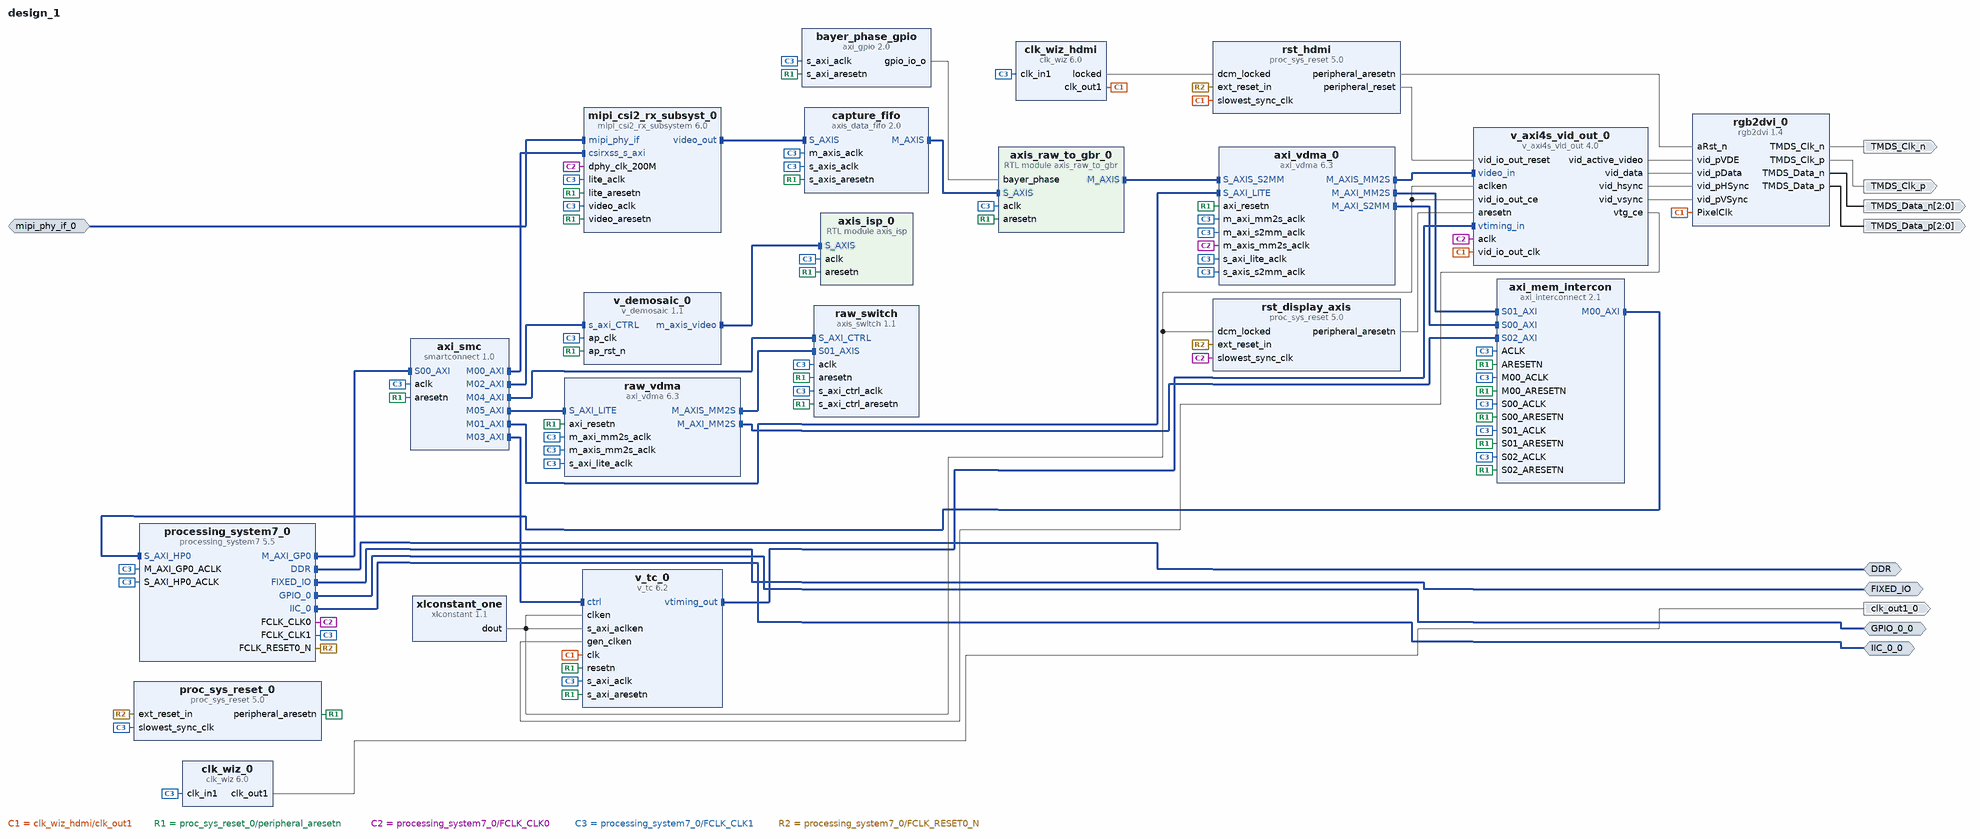
[diagram p0: block diagram of the top level]
# Vivado block design design_1, xc7z020clg400-1, Vivado 2025.2
create_bd_design design_1

create_bd_intf_port -mode Master -vlnv xilinx.com:interface:ddrx_rtl:1.0 DDR
create_bd_intf_port -mode Master -vlnv xilinx.com:display_processing_system7:fixedio_rtl:1.0 FIXED_IO
create_bd_intf_port -mode Master -vlnv xilinx.com:interface:iic_rtl:1.0 IIC_0_0
create_bd_intf_port -mode Master -vlnv xilinx.com:interface:gpio_rtl:1.0 GPIO_0_0
create_bd_intf_port -mode Slave -vlnv xilinx.com:interface:mipi_phy_rtl:1.0 mipi_phy_if_0
create_bd_port -dir O -type clk clk_out1_0
create_bd_port -dir O TMDS_Clk_p
create_bd_port -dir O TMDS_Clk_n
create_bd_port -dir O -from 2 -to 0 TMDS_Data_p
create_bd_port -dir O -from 2 -to 0 TMDS_Data_n

create_bd_cell -type ip -vlnv xilinx.com:ip:processing_system7:5.5 processing_system7_0
set_property -dict [list \
  CONFIG.PCW_APU_PERIPHERAL_FREQMHZ 666.666666 \
  CONFIG.PCW_ENET0_ENET0_IO {MIO 16 .. 27} \
  CONFIG.PCW_ENET0_GRP_MDIO_ENABLE 1 \
  CONFIG.PCW_ENET0_GRP_MDIO_IO {MIO 52 .. 53} \
  CONFIG.PCW_ENET0_PERIPHERAL_ENABLE 1 \
  CONFIG.PCW_EN_CLK1_PORT 1 \
  CONFIG.PCW_EN_CLK2_PORT 1 \
  CONFIG.PCW_FCLK_CLK1_BUF TRUE \
  CONFIG.PCW_FCLK_CLK2_BUF TRUE \
  CONFIG.PCW_FPGA0_PERIPHERAL_FREQMHZ 200 \
  CONFIG.PCW_FPGA1_PERIPHERAL_FREQMHZ 100 \
  CONFIG.PCW_FPGA_FCLK1_ENABLE 1 \
  CONFIG.PCW_FPGA_FCLK2_ENABLE 1 \
  CONFIG.PCW_GPIO_EMIO_GPIO_ENABLE 1 \
  CONFIG.PCW_GPIO_EMIO_GPIO_IO 1 \
  CONFIG.PCW_GPIO_EMIO_GPIO_WIDTH 1 \
  CONFIG.PCW_GPIO_MIO_GPIO_ENABLE 0 \
  CONFIG.PCW_I2C0_I2C0_IO EMIO \
  CONFIG.PCW_I2C0_PERIPHERAL_ENABLE 1 \
  CONFIG.PCW_I2C_PERIPHERAL_FREQMHZ 111.111115 \
  CONFIG.PCW_PRESET_BANK1_VOLTAGE {LVCMOS 1.8V} \
  CONFIG.PCW_QSPI_GRP_FBCLK_ENABLE 1 \
  CONFIG.PCW_QSPI_GRP_FBCLK_IO {MIO 8} \
  CONFIG.PCW_QSPI_GRP_SINGLE_SS_ENABLE 1 \
  CONFIG.PCW_QSPI_GRP_SINGLE_SS_IO {MIO 1 .. 6} \
  CONFIG.PCW_QSPI_PERIPHERAL_ENABLE 1 \
  CONFIG.PCW_QSPI_QSPI_IO {MIO 1 .. 6} \
  CONFIG.PCW_SD0_GRP_CD_ENABLE 1 \
  CONFIG.PCW_SD0_GRP_CD_IO {MIO 47} \
  CONFIG.PCW_SD0_GRP_WP_ENABLE 0 \
  CONFIG.PCW_SD0_PERIPHERAL_ENABLE 1 \
  CONFIG.PCW_SD0_SD0_IO {MIO 40 .. 45} \
  CONFIG.PCW_SDIO_PERIPHERAL_FREQMHZ 50 \
  CONFIG.PCW_SINGLE_QSPI_DATA_MODE x4 \
  CONFIG.PCW_UART1_PERIPHERAL_ENABLE 1 \
  CONFIG.PCW_UART1_UART1_IO {MIO 48 .. 49} \
  CONFIG.PCW_UART_PERIPHERAL_FREQMHZ 100 \
  CONFIG.PCW_UIPARAM_DDR_FREQ_MHZ 533.333333 \
  CONFIG.PCW_UIPARAM_DDR_MEMORY_TYPE {DDR 3 (Low Voltage)} \
  CONFIG.PCW_UIPARAM_DDR_PARTNO {MT41K256M16 RE-125} \
  CONFIG.PCW_USB0_PERIPHERAL_ENABLE 1 \
  CONFIG.PCW_USB0_USB0_IO {MIO 28 .. 39} \
  CONFIG.PCW_USE_S_AXI_HP0 1 \
] [get_bd_cells processing_system7_0]
# 264 more settings of processing_system7_0 are not shown: defaults, MIO pin electricals, DDR timing, and values the tool derives
create_bd_cell -type ip -vlnv xilinx.com:ip:proc_sys_reset:5.0 proc_sys_reset_0
create_bd_cell -type ip -vlnv xilinx.com:ip:mipi_csi2_rx_subsystem:6.0 mipi_csi2_rx_subsyst_0
set_property -dict [list \
  CONFIG.CMN_NUM_LANES 2 \
  CONFIG.CMN_PXL_FORMAT RAW10 \
  CONFIG.C_EN_7S_LINERATE_CHECK true \
  CONFIG.DPY_LINE_RATE 912 \
] [get_bd_cells mipi_csi2_rx_subsyst_0]
create_bd_cell -type ip -vlnv xilinx.com:ip:smartconnect:1.0 axi_smc
set_property -dict {CONFIG.NUM_MI 6 CONFIG.NUM_SI 1} [get_bd_cells axi_smc]
create_bd_cell -type ip -vlnv xilinx.com:ip:axi_vdma:6.3 axi_vdma_0
set_property -dict [list \
  CONFIG.c_enable_vert_flip 0 \
  CONFIG.c_include_mm2s 1 \
  CONFIG.c_m_axi_s2mm_data_width 64 \
  CONFIG.c_m_axis_mm2s_tdata_width 24 \
  CONFIG.c_mm2s_linebuffer_depth 4096 \
  CONFIG.c_mm2s_max_burst_length 32 \
  CONFIG.c_num_fstores 5 \
  CONFIG.c_s2mm_linebuffer_depth 4096 \
  CONFIG.c_s2mm_max_burst_length 32 \
  CONFIG.c_s2mm_sof_enable 1 \
  CONFIG.c_use_mm2s_fsync 0 \
  CONFIG.c_use_s2mm_fsync 2 \
] [get_bd_cells axi_vdma_0]
create_bd_cell -type ip -vlnv xilinx.com:ip:axi_interconnect:2.1 axi_mem_intercon
set_property -dict {CONFIG.NUM_MI 1 CONFIG.NUM_SI 3} [get_bd_cells axi_mem_intercon]
create_bd_cell -type ip -vlnv xilinx.com:ip:clk_wiz:6.0 clk_wiz_0
set_property -dict [list \
  CONFIG.CLKOUT1_JITTER 305.592 \
  CONFIG.CLKOUT1_PHASE_ERROR 298.923 \
  CONFIG.CLKOUT1_REQUESTED_OUT_FREQ 24.000 \
  CONFIG.MMCM_CLKFBOUT_MULT_F 50.250 \
  CONFIG.MMCM_CLKOUT0_DIVIDE_F 41.875 \
  CONFIG.MMCM_DIVCLK_DIVIDE 5 \
  CONFIG.PRIM_SOURCE No_buffer \
  CONFIG.USE_LOCKED false \
  CONFIG.USE_RESET false \
] [get_bd_cells clk_wiz_0]
create_bd_cell -type ip -vlnv xilinx.com:ip:v_demosaic:1.1 v_demosaic_0
set_property -dict [list \
  CONFIG.MAX_COLS 1920 \
  CONFIG.MAX_DATA_WIDTH 10 \
  CONFIG.MAX_ROWS 1080 \
  CONFIG.SAMPLES_PER_CLOCK 1 \
] [get_bd_cells v_demosaic_0]
create_bd_cell -type ip -vlnv xilinx.com:ip:clk_wiz:6.0 clk_wiz_hdmi
set_property -dict [list \
  CONFIG.CLKOUT1_REQUESTED_OUT_FREQ 74.250 \
  CONFIG.PRIM_IN_FREQ 100.000 \
  CONFIG.USE_LOCKED true \
  CONFIG.USE_RESET false \
] [get_bd_cells clk_wiz_hdmi]
create_bd_cell -type ip -vlnv xilinx.com:ip:proc_sys_reset:5.0 rst_hdmi
create_bd_cell -type ip -vlnv xilinx.com:ip:v_tc:6.2 v_tc_0
set_property -dict {CONFIG.VIDEO_MODE 1080p CONFIG.enable_detection false CONFIG.enable_generation true} [get_bd_cells v_tc_0]
create_bd_cell -type ip -vlnv xilinx.com:ip:v_axi4s_vid_out:4.0 v_axi4s_vid_out_0
set_property -dict [list \
  CONFIG.C_ADDR_WIDTH 12 \
  CONFIG.C_HAS_ASYNC_CLK 1 \
  CONFIG.C_NATIVE_COMPONENT_WIDTH 8 \
  CONFIG.C_PIXELS_PER_CLOCK 1 \
  CONFIG.C_VTG_MASTER_SLAVE 0 \
] [get_bd_cells v_axi4s_vid_out_0]
create_bd_cell -type ip -vlnv digilentinc.com:ip:rgb2dvi:1.4 rgb2dvi_0
set_property -dict [list \
  CONFIG.kClkPrimitive MMCM \
  CONFIG.kClkRange 2 \
  CONFIG.kGenerateSerialClk true \
  CONFIG.kRstActiveHigh false \
] [get_bd_cells rgb2dvi_0]
create_bd_cell -type ip -vlnv xilinx.com:ip:xlconstant:1.1 xlconstant_one
set_property -dict {CONFIG.CONST_VAL 1 CONFIG.CONST_WIDTH 1} [get_bd_cells xlconstant_one]
create_bd_cell -type ip -vlnv xilinx.com:ip:proc_sys_reset:5.0 rst_display_axis
create_bd_cell -type module -reference axis_isp axis_isp_0
create_bd_cell -type ip -vlnv xilinx.com:ip:axis_switch:1.1 raw_switch
set_property -dict [list \
  CONFIG.HAS_TLAST 1 \
  CONFIG.NUM_MI 1 \
  CONFIG.NUM_SI 2 \
  CONFIG.ROUTING_MODE 1 \
  CONFIG.TDATA_NUM_BYTES 2 \
  CONFIG.TUSER_WIDTH 1 \
] [get_bd_cells raw_switch]
create_bd_cell -type ip -vlnv xilinx.com:ip:axi_vdma:6.3 raw_vdma
set_property -dict [list \
  CONFIG.c_include_mm2s 1 \
  CONFIG.c_include_s2mm 0 \
  CONFIG.c_m_axis_mm2s_tdata_width 16 \
  CONFIG.c_mm2s_linebuffer_depth 4096 \
  CONFIG.c_mm2s_max_burst_length 32 \
  CONFIG.c_num_fstores 5 \
  CONFIG.c_use_mm2s_fsync 0 \
] [get_bd_cells raw_vdma]
create_bd_cell -type module -reference axis_raw_to_gbr axis_raw_to_gbr_0
create_bd_cell -type ip -vlnv xilinx.com:ip:axi_gpio:2.0 bayer_phase_gpio
set_property -dict {CONFIG.C_ALL_OUTPUTS 1 CONFIG.C_DOUT_DEFAULT 0x00000000 CONFIG.C_GPIO_WIDTH 2} [get_bd_cells bayer_phase_gpio]
create_bd_cell -type ip -vlnv xilinx.com:ip:axis_data_fifo:2.0 capture_fifo
set_property -dict [list \
  CONFIG.FIFO_DEPTH 4096 \
  CONFIG.HAS_TLAST 1 \
  CONFIG.IS_ACLK_ASYNC 1 \
  CONFIG.TDATA_NUM_BYTES 2 \
  CONFIG.TUSER_WIDTH 1 \
] [get_bd_cells capture_fifo]

# ---- connections ----

connect_bd_intf_net [get_bd_intf_pins axi_mem_intercon/M00_AXI] [get_bd_intf_pins processing_system7_0/S_AXI_HP0]
connect_bd_intf_net [get_bd_intf_pins axi_smc/M00_AXI] [get_bd_intf_pins mipi_csi2_rx_subsyst_0/csirxss_s_axi]
connect_bd_intf_net [get_bd_intf_pins axi_smc/M01_AXI] [get_bd_intf_pins axi_vdma_0/S_AXI_LITE]
connect_bd_intf_net [get_bd_intf_pins axi_smc/M02_AXI] [get_bd_intf_pins v_demosaic_0/s_axi_CTRL]
connect_bd_intf_net [get_bd_intf_pins axi_smc/M03_AXI] [get_bd_intf_pins v_tc_0/ctrl]
connect_bd_intf_net [get_bd_intf_pins axi_smc/M04_AXI] [get_bd_intf_pins raw_switch/S_AXI_CTRL]
connect_bd_intf_net [get_bd_intf_pins axi_smc/M05_AXI] [get_bd_intf_pins raw_vdma/S_AXI_LITE]
connect_bd_intf_net [get_bd_intf_pins axi_vdma_0/M_AXIS_MM2S] [get_bd_intf_pins v_axi4s_vid_out_0/video_in]
connect_bd_intf_net [get_bd_intf_pins axi_vdma_0/M_AXI_MM2S] [get_bd_intf_pins axi_mem_intercon/S01_AXI]
connect_bd_intf_net [get_bd_intf_pins axi_vdma_0/M_AXI_S2MM] [get_bd_intf_pins axi_mem_intercon/S00_AXI]
connect_bd_intf_net [get_bd_intf_pins axis_raw_to_gbr_0/M_AXIS] [get_bd_intf_pins axi_vdma_0/S_AXIS_S2MM]
connect_bd_intf_net [get_bd_intf_pins mipi_csi2_rx_subsyst_0/video_out] [get_bd_intf_pins capture_fifo/S_AXIS]
connect_bd_intf_net -intf_net mipi_csi2_rx_subsyst_0_video_out1 [get_bd_intf_pins axis_raw_to_gbr_0/S_AXIS] [get_bd_intf_pins capture_fifo/M_AXIS]
connect_bd_intf_net -intf_net mipi_phy_if_0_1 [get_bd_intf_ports mipi_phy_if_0] [get_bd_intf_pins mipi_csi2_rx_subsyst_0/mipi_phy_if]
connect_bd_intf_net [get_bd_intf_ports DDR] [get_bd_intf_pins processing_system7_0/DDR]
connect_bd_intf_net [get_bd_intf_ports FIXED_IO] [get_bd_intf_pins processing_system7_0/FIXED_IO]
connect_bd_intf_net [get_bd_intf_ports GPIO_0_0] [get_bd_intf_pins processing_system7_0/GPIO_0]
connect_bd_intf_net [get_bd_intf_ports IIC_0_0] [get_bd_intf_pins processing_system7_0/IIC_0]
connect_bd_intf_net [get_bd_intf_pins processing_system7_0/M_AXI_GP0] [get_bd_intf_pins axi_smc/S00_AXI]
connect_bd_intf_net [get_bd_intf_pins raw_vdma/M_AXIS_MM2S] [get_bd_intf_pins raw_switch/S01_AXIS]
connect_bd_intf_net [get_bd_intf_pins raw_vdma/M_AXI_MM2S] [get_bd_intf_pins axi_mem_intercon/S02_AXI]
connect_bd_intf_net [get_bd_intf_pins v_demosaic_0/m_axis_video] [get_bd_intf_pins axis_isp_0/S_AXIS]
connect_bd_intf_net [get_bd_intf_pins v_tc_0/vtiming_out] [get_bd_intf_pins v_axi4s_vid_out_0/vtiming_in]
connect_bd_net [get_bd_pins bayer_phase_gpio/gpio_io_o] [get_bd_pins axis_raw_to_gbr_0/bayer_phase]
connect_bd_net [get_bd_pins clk_wiz_0/clk_out1] [get_bd_ports clk_out1_0]
connect_bd_net [get_bd_pins clk_wiz_hdmi/clk_out1] \
  [get_bd_pins rst_hdmi/slowest_sync_clk] [get_bd_pins v_tc_0/clk] [get_bd_pins v_axi4s_vid_out_0/vid_io_out_clk] \
  [get_bd_pins rgb2dvi_0/PixelClk]
connect_bd_net [get_bd_pins clk_wiz_hdmi/locked] [get_bd_pins rst_hdmi/dcm_locked]
connect_bd_net [get_bd_pins proc_sys_reset_0/peripheral_aresetn] \
  [get_bd_pins mipi_csi2_rx_subsyst_0/lite_aresetn] [get_bd_pins axi_smc/aresetn] [get_bd_pins axi_mem_intercon/S00_ARESETN] \
  [get_bd_pins axi_mem_intercon/M00_ARESETN] [get_bd_pins axi_mem_intercon/ARESETN] [get_bd_pins axi_vdma_0/axi_resetn] \
  [get_bd_pins v_demosaic_0/ap_rst_n] [get_bd_pins v_tc_0/s_axi_aresetn] [get_bd_pins axi_mem_intercon/S01_ARESETN] \
  [get_bd_pins axi_mem_intercon/S02_ARESETN] [get_bd_pins bayer_phase_gpio/s_axi_aresetn] [get_bd_pins v_tc_0/resetn] \
  [get_bd_pins mipi_csi2_rx_subsyst_0/video_aresetn] [get_bd_pins capture_fifo/s_axis_aresetn] \
  [get_bd_pins axis_raw_to_gbr_0/aresetn] [get_bd_pins axis_isp_0/aresetn] [get_bd_pins raw_switch/aresetn] \
  [get_bd_pins raw_switch/s_axi_ctrl_aresetn] [get_bd_pins raw_vdma/axi_resetn]
connect_bd_net [get_bd_pins processing_system7_0/FCLK_CLK0] \
  [get_bd_pins mipi_csi2_rx_subsyst_0/dphy_clk_200M] [get_bd_pins rst_display_axis/slowest_sync_clk] \
  [get_bd_pins axi_vdma_0/m_axis_mm2s_aclk] [get_bd_pins v_axi4s_vid_out_0/aclk]
connect_bd_net [get_bd_pins processing_system7_0/FCLK_CLK1] \
  [get_bd_pins processing_system7_0/M_AXI_GP0_ACLK] [get_bd_pins processing_system7_0/S_AXI_HP0_ACLK] \
  [get_bd_pins proc_sys_reset_0/slowest_sync_clk] [get_bd_pins axi_smc/aclk] [get_bd_pins mipi_csi2_rx_subsyst_0/lite_aclk] \
  [get_bd_pins axi_mem_intercon/ACLK] [get_bd_pins axi_mem_intercon/S00_ACLK] [get_bd_pins axi_mem_intercon/M00_ACLK] \
  [get_bd_pins clk_wiz_0/clk_in1] [get_bd_pins axi_vdma_0/s_axi_lite_aclk] [get_bd_pins axi_vdma_0/m_axi_s2mm_aclk] \
  [get_bd_pins v_demosaic_0/ap_clk] [get_bd_pins axi_vdma_0/m_axi_mm2s_aclk] [get_bd_pins v_tc_0/s_axi_aclk] \
  [get_bd_pins clk_wiz_hdmi/clk_in1] [get_bd_pins axi_mem_intercon/S01_ACLK] [get_bd_pins axi_mem_intercon/S02_ACLK] \
  [get_bd_pins bayer_phase_gpio/s_axi_aclk] [get_bd_pins mipi_csi2_rx_subsyst_0/video_aclk] \
  [get_bd_pins capture_fifo/s_axis_aclk] [get_bd_pins capture_fifo/m_axis_aclk] [get_bd_pins axis_raw_to_gbr_0/aclk] \
  [get_bd_pins axi_vdma_0/s_axis_s2mm_aclk] [get_bd_pins axis_isp_0/aclk] [get_bd_pins raw_switch/aclk] \
  [get_bd_pins raw_switch/s_axi_ctrl_aclk] [get_bd_pins raw_vdma/s_axi_lite_aclk] [get_bd_pins raw_vdma/m_axi_mm2s_aclk] \
  [get_bd_pins raw_vdma/m_axis_mm2s_aclk]
connect_bd_net [get_bd_pins processing_system7_0/FCLK_RESET0_N] \
  [get_bd_pins proc_sys_reset_0/ext_reset_in] [get_bd_pins rst_hdmi/ext_reset_in] [get_bd_pins rst_display_axis/ext_reset_in]
connect_bd_net [get_bd_pins rgb2dvi_0/TMDS_Clk_n] [get_bd_ports TMDS_Clk_n]
connect_bd_net [get_bd_pins rgb2dvi_0/TMDS_Clk_p] [get_bd_ports TMDS_Clk_p]
connect_bd_net [get_bd_pins rgb2dvi_0/TMDS_Data_n] [get_bd_ports TMDS_Data_n]
connect_bd_net [get_bd_pins rgb2dvi_0/TMDS_Data_p] [get_bd_ports TMDS_Data_p]
connect_bd_net [get_bd_pins rst_display_axis/peripheral_aresetn] [get_bd_pins v_axi4s_vid_out_0/aresetn]
connect_bd_net [get_bd_pins rst_hdmi/peripheral_aresetn] [get_bd_pins rgb2dvi_0/aRst_n]
connect_bd_net [get_bd_pins rst_hdmi/peripheral_reset] [get_bd_pins v_axi4s_vid_out_0/vid_io_out_reset]
connect_bd_net [get_bd_pins v_axi4s_vid_out_0/vid_active_video] [get_bd_pins rgb2dvi_0/vid_pVDE]
connect_bd_net [get_bd_pins v_axi4s_vid_out_0/vid_data] [get_bd_pins rgb2dvi_0/vid_pData]
connect_bd_net [get_bd_pins v_axi4s_vid_out_0/vid_hsync] [get_bd_pins rgb2dvi_0/vid_pHSync]
connect_bd_net [get_bd_pins v_axi4s_vid_out_0/vid_vsync] [get_bd_pins rgb2dvi_0/vid_pVSync]
connect_bd_net [get_bd_pins v_axi4s_vid_out_0/vtg_ce] [get_bd_pins v_tc_0/gen_clken]
connect_bd_net [get_bd_pins xlconstant_one/dout] \
  [get_bd_pins v_tc_0/s_axi_aclken] [get_bd_pins v_tc_0/clken] [get_bd_pins rst_display_axis/dcm_locked] \
  [get_bd_pins v_axi4s_vid_out_0/aclken] [get_bd_pins v_axi4s_vid_out_0/vid_io_out_ce]

# ---- address map ----
assign_bd_address -offset 0x00000000 -range 1G -target_address_space [get_bd_addr_spaces axi_vdma_0/Data_MM2S] [get_bd_addr_segs processing_system7_0/S_AXI_HP0/HP0_DDR_LOWOCM]
assign_bd_address -offset 0x00000000 -range 1G -target_address_space [get_bd_addr_spaces axi_vdma_0/Data_S2MM] [get_bd_addr_segs processing_system7_0/S_AXI_HP0/HP0_DDR_LOWOCM]
assign_bd_address -offset 0x43000000 -range 64K -target_address_space [get_bd_addr_spaces processing_system7_0/Data] [get_bd_addr_segs axi_vdma_0/S_AXI_LITE/Reg]
assign_bd_address -offset 0x43010000 -range 64K -target_address_space [get_bd_addr_spaces processing_system7_0/Data] [get_bd_addr_segs raw_vdma/S_AXI_LITE/Reg]
assign_bd_address -offset 0x43C00000 -range 4K -target_address_space [get_bd_addr_spaces processing_system7_0/Data] [get_bd_addr_segs mipi_csi2_rx_subsyst_0/csirxss_s_axi/Reg]
assign_bd_address -offset 0x43C10000 -range 64K -target_address_space [get_bd_addr_spaces processing_system7_0/Data] [get_bd_addr_segs v_demosaic_0/s_axi_CTRL/Reg]
assign_bd_address -offset 0x43C20000 -range 64K -target_address_space [get_bd_addr_spaces processing_system7_0/Data] [get_bd_addr_segs v_tc_0/ctrl/Reg]
assign_bd_address -offset 0x43C30000 -range 64K -target_address_space [get_bd_addr_spaces processing_system7_0/Data] [get_bd_addr_segs raw_switch/S_AXI_CTRL/Reg]
assign_bd_address -offset 0x00000000 -range 1G -target_address_space [get_bd_addr_spaces raw_vdma/Data_MM2S] [get_bd_addr_segs processing_system7_0/S_AXI_HP0/HP0_DDR_LOWOCM]

validate_bd_design
save_bd_design
